# Altium project MezzRev4.PrjPcb (part 4 of 4)

## Sheet DfMUX_Power.SchDoc: Digital fMUX Mezzanine - Power
size 513 x 386 mm; Engineer: M.Dobbs, McGill U.; Revision: 4
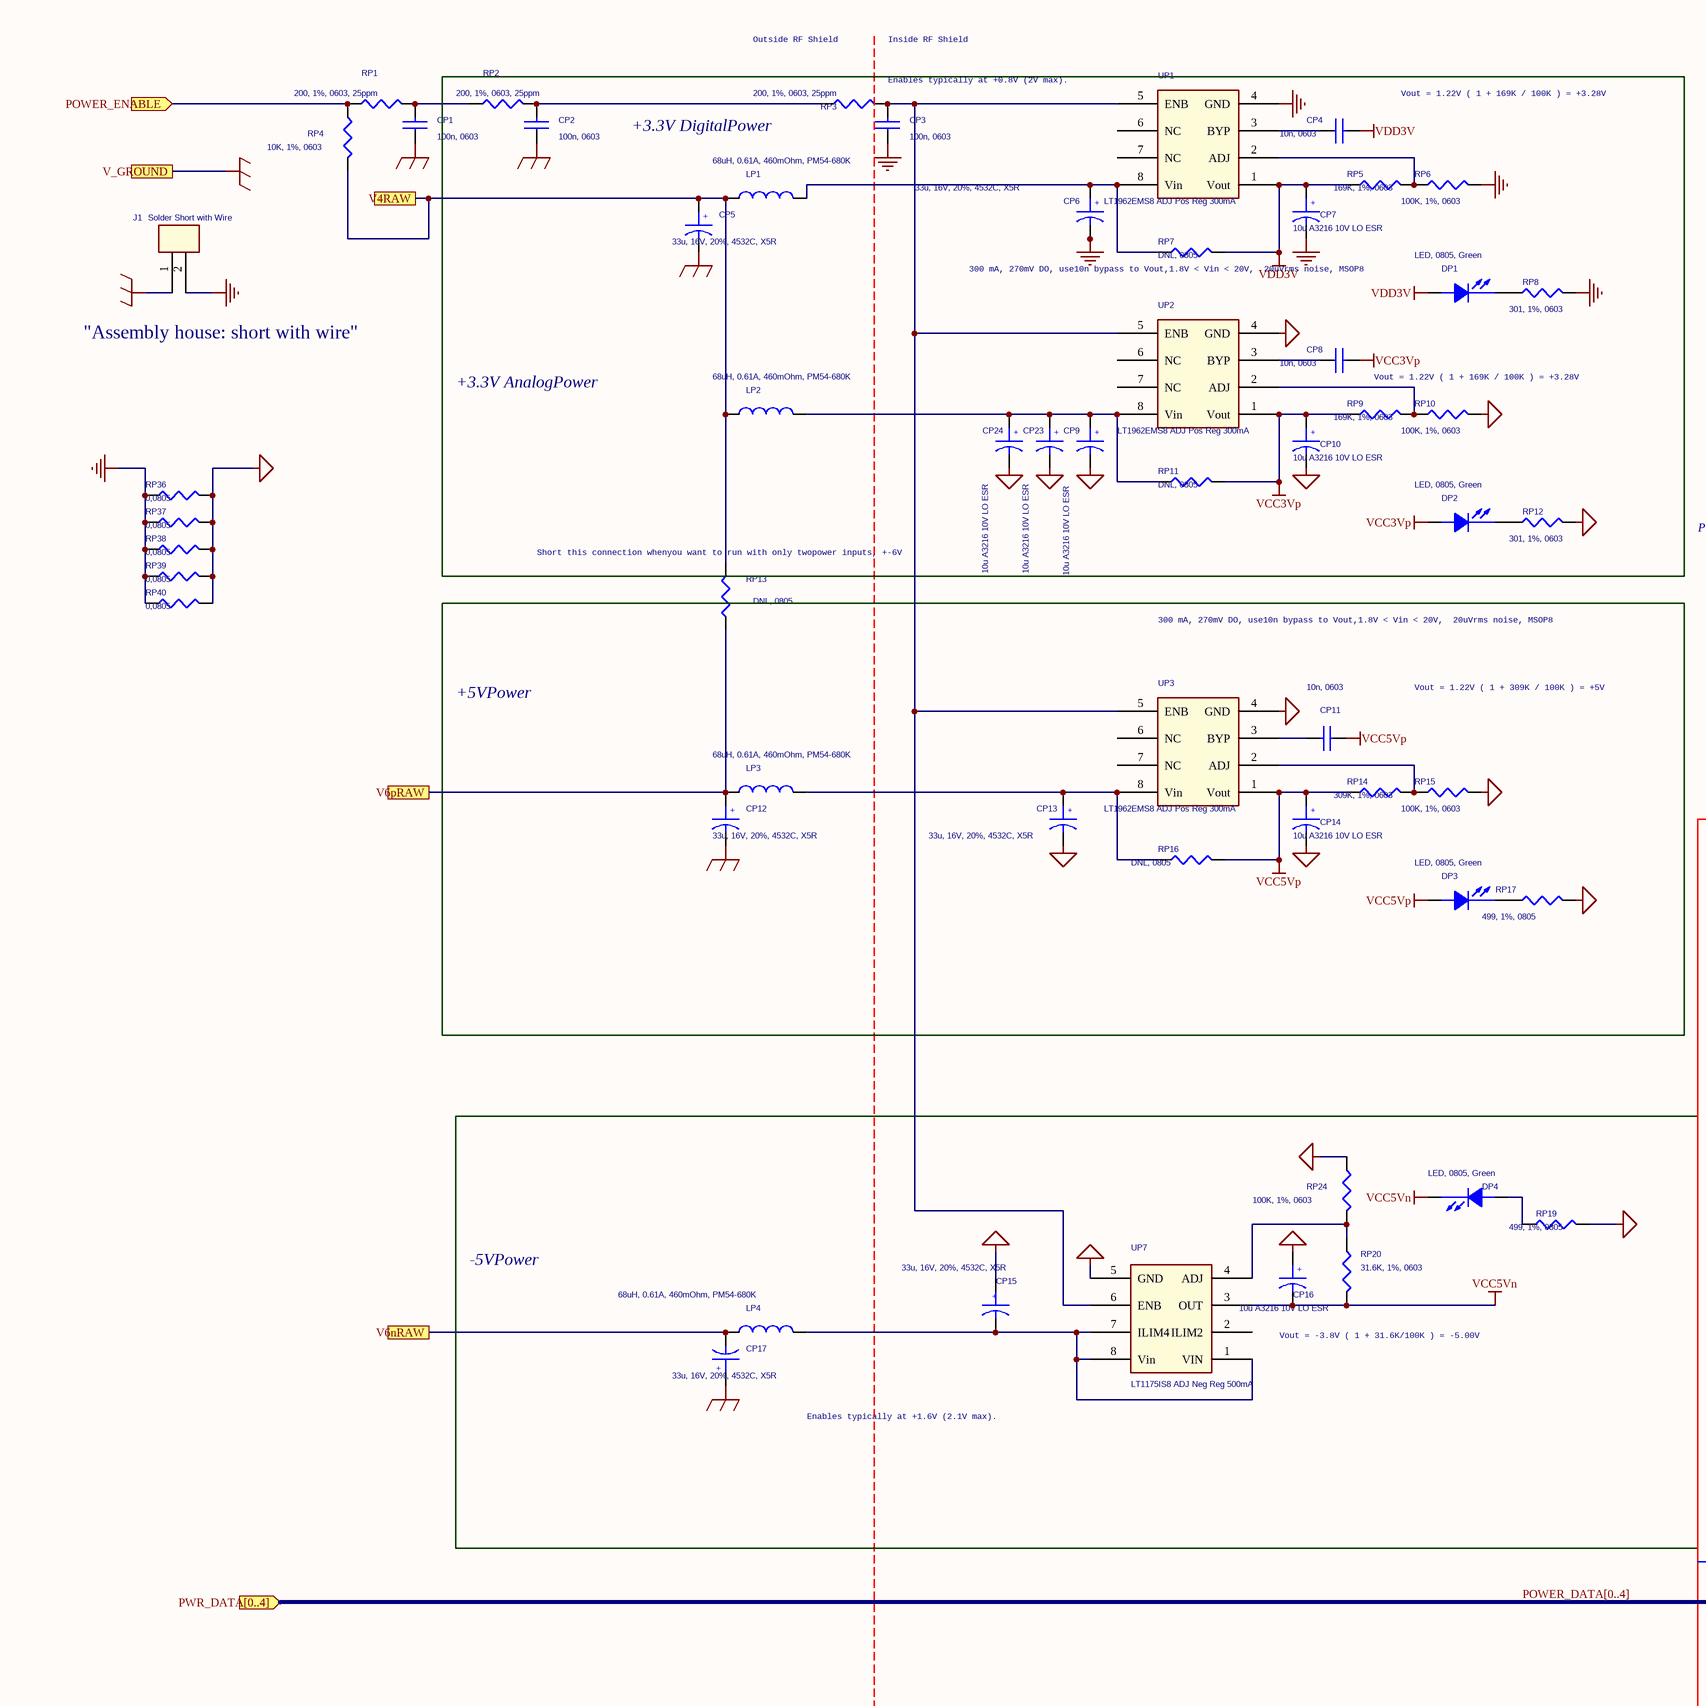
[diagram p7: DfMUX_Power.SchDoc, left]
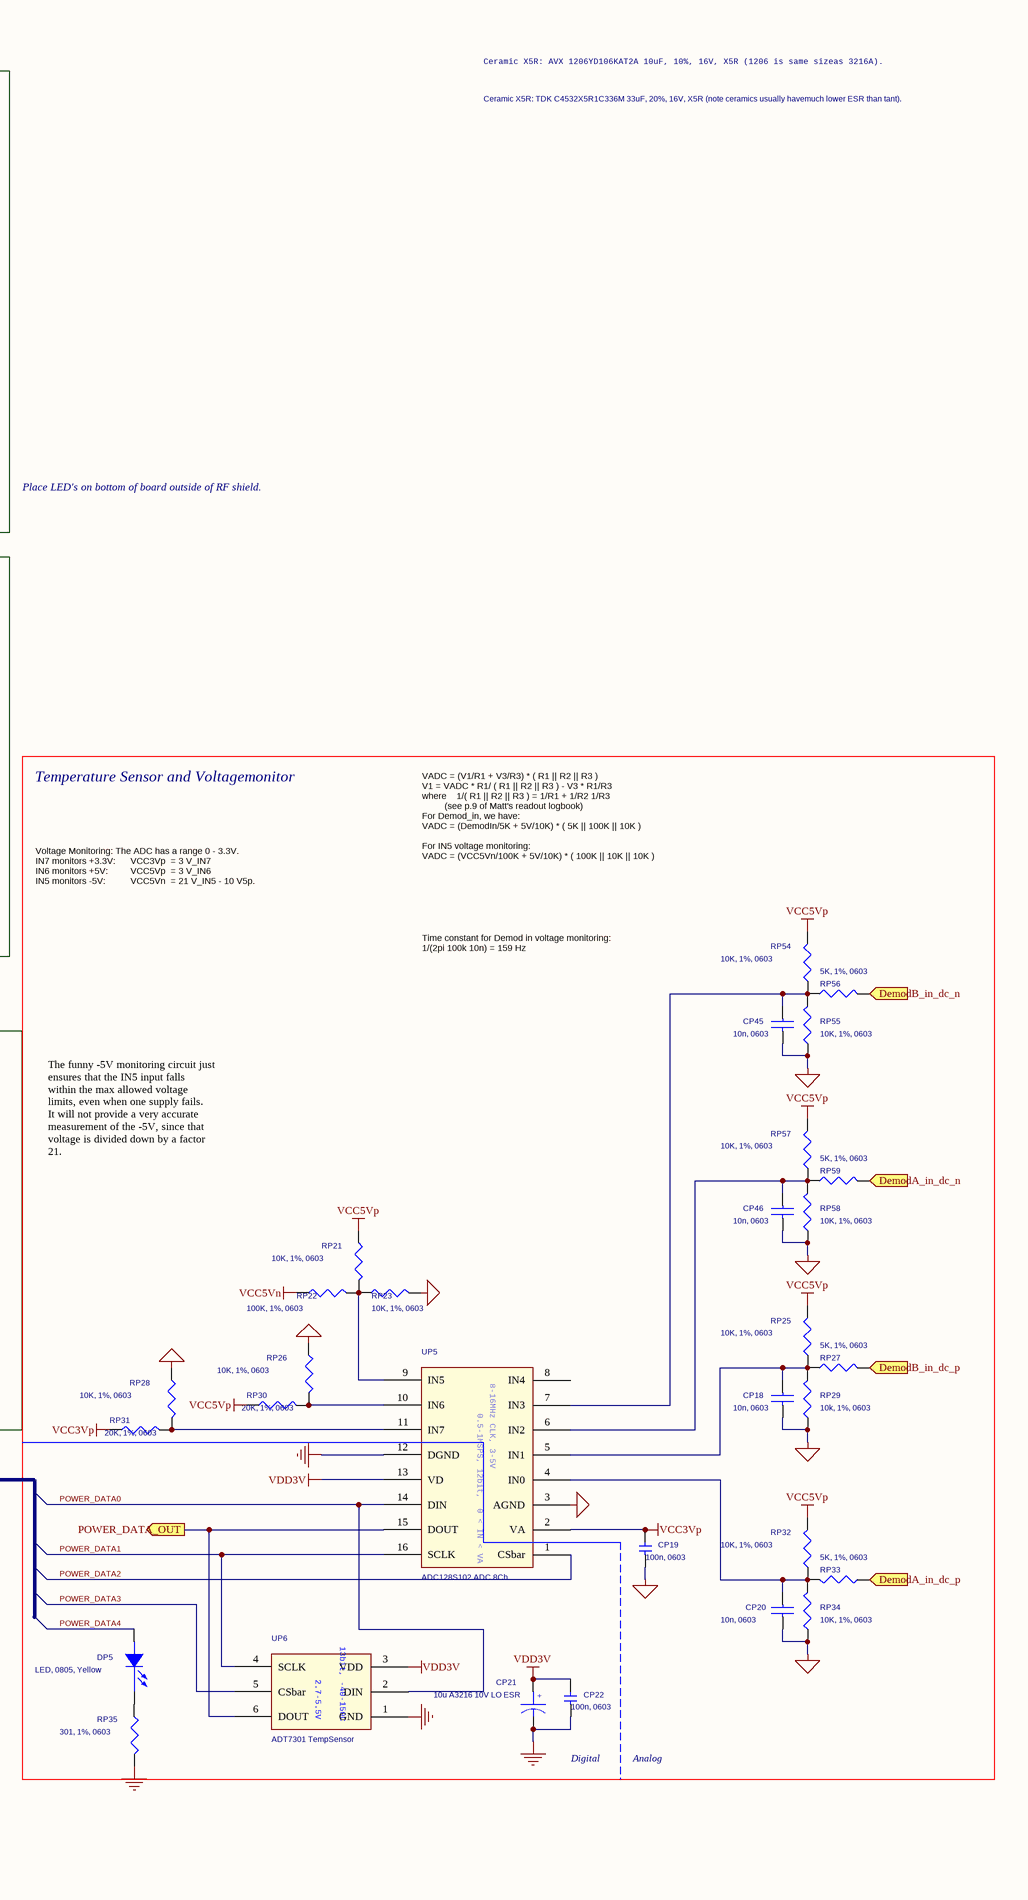
[diagram p8: DfMUX_Power.SchDoc, right]

### Parts
CP1  100n, 0603  [0603C]
CP2  100n, 0603  [0603C]
CP3  100n, 0603  [0603C]
CP4  10n, 0603  [0603C]
CP5  33u, 16V, 20%, 4532C, X5R  [TANT4532]
CP6  33u, 16V, 20%, 4532C, X5R  [TANT4532]
CP7  10u A3216 10V LO ESR  [TANTA]
CP8  10n, 0603  [0603C]
CP9  10u A3216 10V LO ESR  [TANTA]
CP10  10u A3216 10V LO ESR  [TANTA]
CP11  10n, 0603  [0603C]
CP12  33u, 16V, 20%, 4532C, X5R  [TANT4532]
CP13  33u, 16V, 20%, 4532C, X5R  [TANT4532]
CP14  10u A3216 10V LO ESR  [TANTA]
CP15  33u, 16V, 20%, 4532C, X5R  [TANT4532]
CP16  10u A3216 10V LO ESR  [TANTA]
CP17  33u, 16V, 20%, 4532C, X5R  [TANT4532]
CP18  10n, 0603  [0603C]
CP19  100n, 0603  [0603C]
CP20  10n, 0603  [0603C]
CP21  10u A3216 10V LO ESR  [TANTA]
CP22  100n, 0603  [0603C]
CP23  10u A3216 10V LO ESR  [TANTA]
CP24  10u A3216 10V LO ESR  [TANTA]
CP45  10n, 0603  [0603C]
CP46  10n, 0603  [0603C]
DP1  LED, 0805, Green  [0805L]
DP2  LED, 0805, Green  [0805L]
DP3  LED, 0805, Green  [0805L]
DP4  LED, 0805, Green  [0805L]
DP5  LED, 0805, Yellow  [0805L]
J1  Solder Short with Wire  [BLKCON.100/VH/TM1SQS/W.100/2]
LP1  68uH, 0.61A, 460mOhm, PM54-680K  [CHOKEPM54]
LP2  68uH, 0.61A, 460mOhm, PM54-680K  [CHOKEPM54]
LP3  68uH, 0.61A, 460mOhm, PM54-680K  [CHOKEPM54]
LP4  68uH, 0.61A, 460mOhm, PM54-680K  [CHOKEPM54]
RP1  200, 1%, 0603, 25ppm  [0603R]
RP2  200, 1%, 0603, 25ppm  [0603R]
RP3  200, 1%, 0603, 25ppm  [0603R]
RP4  10K, 1%, 0603  [0603R]
RP5  169K, 1%, 0603  [0603R]
RP6  100K, 1%, 0603  [0603R]
RP7  DNL, 0805  [0805R]
RP8  301, 1%, 0603  [0603R]
RP9  169K, 1%, 0603  [0603R]
RP10  100K, 1%, 0603  [0603R]
RP11  DNL, 0805  [0805R]
RP12  301, 1%, 0603  [0603R]
RP13  DNL, 0805  [0805R]
RP14  309K, 1%, 0603  [0603R]
RP15  100K, 1%, 0603  [0603R]
RP16  DNL, 0805  [0805R]
RP17  499, 1%, 0805  [0805R]
RP19  499, 1%, 0805  [0805R]
RP20  31.6K, 1%, 0603  [0603R]
RP21  10K, 1%, 0603  [0603R]
RP22  100K, 1%, 0603  [0603R]
RP23  10K, 1%, 0603  [0603R]
RP24  100K, 1%, 0603  [0603R]
RP25  10K, 1%, 0603  [0603R]
RP26  10K, 1%, 0603  [0603R]
RP27  5K, 1%, 0603  [0603R]
RP28  10K, 1%, 0603  [0603R]
RP29  10k, 1%, 0603  [0603R]
RP30  20K, 1%, 0603  [0603R]
RP31  20K, 1%, 0603  [0603R]
RP32  10K, 1%, 0603  [0603R]
RP33  5K, 1%, 0603  [0603R]
RP34  10K, 1%, 0603  [0603R]
RP35  301, 1%, 0603  [0603R]
RP36  0,0805  [0805R]
RP37  0,0805  [0805R]
RP38  0,0805  [0805R]
RP39  0,0805  [0805R]
RP40  0,0805  [0805R]
RP54  10K, 1%, 0603  [0603R]
RP55  10K, 1%, 0603  [0603R]
RP56  5K, 1%, 0603  [0603R]
RP57  10K, 1%, 0603  [0603R]
RP58  10K, 1%, 0603  [0603R]
RP59  5K, 1%, 0603  [0603R]
UP1  LT1962EMS8 ADJ Pos Reg 300mA  [MSOP-8]
UP2  LT1962EMS8 ADJ Pos Reg 300mA  [MSOP-8]
UP3  LT1962EMS8 ADJ Pos Reg 300mA  [MSOP-8]
UP5  ADC128S102 ADC 8Ch  [TSSOP16]
UP6  ADT7301 TempSensor  [SOT23-6]
UP7  LT1175IS8 ADJ Neg Reg 500mA  [SO8/L200]

### Blocks framed on the sheet
+5V / Power: CP11-CP14 DP3 LP3 RP14-RP17 UP3
Temperature Sensor and Voltage / monitor: CP18-CP22 CP45 CP46 DP5 RP21-RP23 RP25-RP35 RP54-RP59 UP5 UP6
-5V / Power: CP15-CP17 DP4 LP4 RP19 RP20 RP24 UP7

### Ports
DemodA_in_dc_n, DemodA_in_dc_p, DemodB_in_dc_n, DemodB_in_dc_p, POWER_DATA_OUT, POWER_ENABLE, PWR_DATA[0..4], V4RAW, V6nRAW, V6pRAW, V_GROUND

### Nets
GND_DIG: CP3.1 CP6.2 CP7.2 CP21.2 CP22.1 J1.2 RP6.2 RP8.2 RP35.2 RP36.1 RP37.1 RP38.1 RP39.1 RP40.1 UP1.4(GND) UP5.12(DGND) UP6.1(GND)
GND_EARTH: CP1.1 CP2.1 CP5.2 CP12.2 CP17.1 J1.1 ; port V_GROUND
GND_SIGNAL: CP9.2 CP10.2 CP13.2 CP14.2 CP15.1 CP16.1 CP18.2 CP19.1 CP20.2 CP23.2 CP24.2 CP45.2 CP46.2 RP10.2 RP12.2 RP15.2 RP17.2 RP19.2 RP23.2 RP24.1 RP26.1 RP28.1 RP29.1 RP34.1 RP36.2 RP37.2 RP38.2 RP39.2 RP40.2 RP55.1 RP58.1 UP2.4(GND) UP3.4(GND) UP5.3(AGND) UP7.5(GND)
VCC3Vp: CP8.2 CP10.1 CP19.2 DP2.1(ANODE) RP9.1 RP11.2 RP31.1 UP2.1(Vout) UP5.2(VA)
VCC5Vn: CP16.2 DP4.2(CATHODE) RP20.2 RP22.1 UP7.3(OUT)
VCC5Vp: CP11.1 CP14.1 DP3.1(ANODE) RP14.1 RP16.2 RP21.1 RP25.2 RP30.1 RP32.2 RP54.2 RP57.2 UP3.1(Vout)
VDD3V: CP4.2 CP7.1 CP21.1 CP22.2 DP1.1(ANODE) RP5.1 RP7.2 UP1.1(Vout) UP5.13(VD) UP6.3(VDD)
POWER_DATA0: UP5.14(DIN) UP6.2(DIN)
POWER_DATA1: UP5.16(SCLK) UP6.4(SCLK)
POWER_DATA2: UP5.1(CSbar)
POWER_DATA3: UP6.5(CSbar)
POWER_DATA4: DP5.1(ANODE)
NetCA46_1: RP56.2 ; port DemodB_in_dc_n
NetCA47_2: RP27.2 ; port DemodB_in_dc_p
NetCA48_1: RP59.2 ; port DemodA_in_dc_n
NetCA49_2: RP33.1 ; port DemodA_in_dc_p
NetCP1_2: CP1.2 RP1.2 RP2.1
NetCP2_2: CP2.2 RP2.2 RP3.1
NetCP3_2: CP3.2 RP3.2 UP1.5(ENB) UP2.5(ENB) UP3.5(ENB) UP7.6(ENB)
NetCP4_1: CP4.1 UP1.3(BYP)
NetCP5_1: CP5.1 LP1.1 LP2.1 RP4.2 RP13.2 ; port V4RAW
NetCP6_1: CP6.1 LP1.2 RP7.1 UP1.8(Vin)
NetCP8_1: CP8.1 UP2.3(BYP)
NetCP9_1: CP9.1 CP23.1 CP24.1 LP2.2 RP11.1 UP2.8(Vin)
NetCP11_2: CP11.2 UP3.3(BYP)
NetCP12_1: CP12.1 LP3.1 RP13.1 ; port V6pRAW
NetCP13_1: CP13.1 LP3.2 RP16.1 UP3.8(Vin)
NetCP15_2: CP15.2 LP4.2 UP7.1(VIN) UP7.7(ILIM4) UP7.8(Vin)
NetCP17_2: CP17.2 LP4.1 ; port V6nRAW
NetCP18_1: CP18.1 RP25.1 RP27.1 RP29.2 UP5.5(IN1)
NetCP20_1: CP20.1 RP32.1 RP33.2 RP34.2 UP5.4(IN0)
NetCP45_1: CP45.1 RP54.1 RP55.2 RP56.1 UP5.7(IN3)
NetCP46_1: CP46.1 RP57.1 RP58.2 RP59.1 UP5.6(IN2)
NetDP1_2: DP1.2(CATHODE) RP8.1
NetDP2_2: DP2.2(CATHODE) RP12.1
NetDP3_2: DP3.2(CATHODE) RP17.1
NetDP4_1: DP4.1(ANODE) RP19.1
NetDP5_2: DP5.2(CATHODE) RP35.1
NetJ5_74: RP1.1 RP4.1 ; port POWER_ENABLE
NetRP5_2: RP5.2 RP6.1 UP1.2(ADJ)
NetRP9_2: RP9.2 RP10.1 UP2.2(ADJ)
NetRP14_2: RP14.2 RP15.1 UP3.2(ADJ)
NetRP20_1: RP20.1 RP24.2 UP7.4(ADJ)
NetRP21_2: RP21.2 RP22.2 RP23.1 UP5.9(IN5)
NetRP26_2: RP26.2 RP30.2 UP5.10(IN6)
NetRP28_2: RP28.2 RP31.2 UP5.11(IN7)
NetUP5_15: UP5.15(DOUT) UP6.6(DOUT) ; port POWER_DATA_OUT

Not connected (* = marked no-connect by the designer): UP1 6(NC) 7(NC); UP2 6(NC) 7(NC); UP3 6(NC) 7(NC); UP5 8(IN4); UP7 2(ILIM2)

### Buses and harness runs
bus POWER_DATA[0..4] = port PWR_DATA[0..4]

### Notes on the sheet
- Outside RF Shield
- Inside RF Shield
- +3.3V DigitalPower
- Enables typically at +0.8V (2V max).
- Vout = 1.22V ( 1 + 169K / 100K ) = +3.28V
- Ceramic X5R: TDK C4532X5R1C336M 33uF, 20%, 16V, X5R (note ceramics usually havemuch lower ESR than tant).
- Ceramic X5R: AVX 1206YD106KAT2A 10uF, 10%, 16V, X5R (1206 is same sizeas 3216A).
- (near RP7) 300 mA, 270mV DO, use10n bypass to Vout,1.8V < Vin < 20V,  20uVrms noise, MSOP8
- "Assembly house: short with wire"
- +3.3V AnalogPower
- Place LED's on bottom of board outside of RF shield.
- (near RP13) Short this connection whenyou want to run with only twopower inputs, +-6V
- 300 mA, 270mV DO, use10n bypass to Vout,1.8V < Vin < 20V,  20uVrms noise, MSOP8
- Vout = 1.22V ( 1 + 309K / 100K ) = +5V
- Voltage Monitoring: The ADC has a range 0 - 3.3V.
  IN7 monitors +3.3V:      VCC3Vp  = 3 V_IN7
  IN6 monitors +5V:         VCC5Vp  = 3 V_IN6
  IN5 monitors -5V:          VCC5Vn  = 21 V_IN5 - 10 V5p.
- (near RP54) VADC = (V1/R1 + V3/R3) * ( R1 || R2 || R3 )
  V1 = VADC * R1/ ( R1 || R2 || R3 ) - V3 * R1/R3
  where    1/( R1 || R2 || R3 ) = 1/R1 + 1/R2 1/R3
  (see p.9 of Matt's readout logbook)
  For Demod_in, we have:
  VADC = (DemodIn/5K + 5V/10K) * ( 5K || 100K || 10K )
  For IN5 voltage monitoring:
  VADC = (VCC5Vn/100K + 5V/10K) * ( 100K || 10K || 10K )
- Time constant for Demod in voltage monitoring:
  1/(2pi 100k 10n) = 159 Hz
- Vout = -3.8V ( 1 + 31.6K/100K ) = -5.00V
- The funny -5V monitoring circuit just
  ensures that the IN5 input falls
  within the max allowed voltage
  limits, even when one supply fails.
  It will not provide a very accurate
  measurement of the -5V, since that
  voltage is divided down by a factor
  21.
- Enables typically at +1.6V (2.1V max).
- Digital
- Analog
- (in symbol ADC128S102 ADC 8Ch) 8-16MHz CLK, 3-5V; 0.5-1MSPS, 12bit,  0 < IN < VA
- (in symbol ADT7301 TempSensor) 13bit, -40-150C; 2.7-5.5V
- (in symbol CAP_POL) +
- (in symbol CAPACITOR POL) +

### Library data of the parts
CP1 = CAP NP: COMPFIXED: NO; COMPGROUP: 0; COMPHEIGHT: 0.000; COMPLOC: [1034.633,740.000]; COMPSIDE: TOP; COMPKEY: NO; COMPLOCKED: NO; COMPROT: 0; DECOUPLER: NO; MEMORY: NO
CP2 = CAP NP: COMPFIXED: NO; COMPGROUP: 0; COMPHEIGHT: 0.000; COMPLOC: [1039.633,1155.000]; COMPSIDE: TOP; COMPKEY: NO; COMPLOCKED: NO; COMPROT: 0; DECOUPLER: NO; MEMORY: NO
CP3 = CAP NP: COMPFIXED: NO; COMPGROUP: 0; COMPHEIGHT: 0.000; COMPLOC: [1372.633,1318.000]; COMPSIDE: BOT; COMPKEY: NO; COMPLOCKED: NO; COMPROT: 0; DECOUPLER: NO; MEMORY: NO
CP4 = CAP NP: COMPFIXED: NO; COMPGROUP: 0; COMPHEIGHT: 0.000; COMPLOC: [1429.633,1320.000]; COMPROT: 180; COMPSIDE: BOT; COMPKEY: NO; COMPLOCKED: NO; DECOUPLER: NO; MEMORY: NO
CP5 = CAP_POL: COMPFIXED: NO; COMPGROUP: 0; COMPHEIGHT: 0.000; COMPLOC: [539.633,1474.367]; COMPSIDE: TOP; COMPKEY: NO; COMPLOCKED: NO; COMPROT: 0; DECOUPLER: NO; MEMORY: NO
CP6 = CAP_POL: COMPFIXED: NO; COMPGROUP: 0; COMPHEIGHT: 0.000; COMPLOC: [1309.633,1595.000]; COMPROT: 90; COMPSIDE: TOP; COMPKEY: NO; COMPLOCKED: NO; DECOUPLER: NO; MEMORY: NO
CP7 = CAP_POL: COMPFIXED: NO; COMPGROUP: 0; COMPHEIGHT: 0.000; COMPLOC: [1523.633,1584.000]; COMPROT: 90; COMPSIDE: TOP; COMPKEY: NO; COMPLOCKED: NO; DECOUPLER: NO; MEMORY: NO
CP8 = CAP NP: COMPFIXED: NO; COMPGROUP: 0; COMPHEIGHT: 0.000; COMPLOC: [2397.633,1480.000]; COMPROT: 90; COMPSIDE: TOP; COMPKEY: NO; COMPLOCKED: NO; DECOUPLER: NO; MEMORY: NO
CP9 = CAP_POL: COMPFIXED: NO; COMPGROUP: 0; COMPHEIGHT: 0.000; COMPLOC: [2205.000,1380.000]; COMPROT: 90; COMPSIDE: BOT; FPLIST: TANT4532; COMPKEY: NO; COMPLOCKED: NO; DECOUPLER: NO; MEMORY: NO
CP10 = CAP_POL: COMPFIXED: NO; COMPGROUP: 0; COMPHEIGHT: 0.000; COMPLOC: [2347.633,1365.000]; COMPSIDE: TOP; COMPKEY: NO; COMPLOCKED: NO; COMPROT: 0; DECOUPLER: NO; MEMORY: NO
CP11 = CAP NP: COMPFIXED: NO; COMPGROUP: 0; COMPHEIGHT: 0.000; COMPLOC: [2267.633,3385.000]; COMPROT: 90; COMPSIDE: BOT; COMPKEY: NO; COMPLOCKED: NO; DECOUPLER: NO; MEMORY: NO
CP12 = CAP_POL: COMPFIXED: NO; COMPGROUP: 0; COMPHEIGHT: 0.000; COMPLOC: [689.633,3195.000]; COMPROT: 270; COMPSIDE: TOP; COMPKEY: NO; COMPLOCKED: NO; DECOUPLER: NO; MEMORY: NO
CP13 = CAP_POL: COMPFIXED: NO; COMPGROUP: 0; COMPHEIGHT: 0.000; COMPLOC: [1619.633,3500.000]; COMPSIDE: TOP; COMPKEY: NO; COMPLOCKED: NO; COMPROT: 0; DECOUPLER: NO; MEMORY: NO
CP14 = CAP_POL: COMPFIXED: NO; COMPGROUP: 0; COMPHEIGHT: 0.000; COMPLOC: [2192.633,3445.000]; COMPROT: 180; COMPSIDE: BOT; COMPKEY: NO; COMPLOCKED: NO; DECOUPLER: NO; MEMORY: NO
CP15 = CAP_POL: COMPFIXED: NO; COMPGROUP: 0; COMPHEIGHT: 0.000; COMPLOC: [2204.633,120.000]; COMPROT: 180; COMPSIDE: TOP; COMPKEY: NO; COMPLOCKED: NO; DECOUPLER: NO; MEMORY: NO
CP16 = CAP_POL: COMPFIXED: NO; COMPGROUP: 0; COMPHEIGHT: 0.000; COMPLOC: [2319.633,355.000]; COMPROT: 180; COMPSIDE: BOT; COMPKEY: NO; COMPLOCKED: NO; DECOUPLER: NO; MEMORY: NO
CP17 = CAP_POL: COMPFIXED: NO; COMPGROUP: 0; COMPHEIGHT: 0.000; COMPLOC: [709.633,385.000]; COMPROT: 180; COMPSIDE: TOP; COMPKEY: NO; COMPLOCKED: NO; DECOUPLER: NO; MEMORY: NO
CP18 = CAP NP: COMPFIXED: NO; COMPGROUP: 0; COMPHEIGHT: 0.000; COMPLOC: [3832.633,1939.367]; COMPROT: 90; COMPSIDE: TOP; COMPKEY: NO; COMPLOCKED: NO; DECOUPLER: NO; MEMORY: NO
CP19 = C: PSpiceTemplate: C^@REFDES %1 %2 ?TOLERANCE|C^@REFDES| @VALUE ?IC/IC=@IC/ ?TOLERANCE|\n.model C^@REFDES CAP C=1 DEV=@TOLERANCE%|; COMPFIXED: NO; COMPGROUP: 0; COMPHEIGHT: 0.000; COMPLOC: [1827.633,1264.367]; COMPSIDE: BOT; Value: 100n, 0603; COMPKEY: NO; COMPLOCKED: NO; COMPROT: 0; DECOUPLER: NO; MEMORY: NO
CP20 = CAP NP: COMPFIXED: NO; COMPGROUP: 0; COMPHEIGHT: 0.000; COMPLOC: [3837.633,1434.367]; COMPROT: 90; COMPSIDE: TOP; COMPKEY: NO; COMPLOCKED: NO; DECOUPLER: NO; MEMORY: NO
CP21 = CAPACITOR POL: COMPFIXED: NO; COMPGROUP: 0; COMPHEIGHT: 0.000; COMPLOC: [1897.633,1559.367]; COMPROT: 180; COMPSIDE: TOP; COMPKEY: NO; COMPLOCKED: NO; DECOUPLER: NO; MEMORY: NO
CP22 = C: PSpiceTemplate: C^@REFDES %1 %2 ?TOLERANCE|C^@REFDES| @VALUE ?IC/IC=@IC/ ?TOLERANCE|\n.model C^@REFDES CAP C=1 DEV=@TOLERANCE%|; COMPFIXED: NO; COMPGROUP: 0; COMPHEIGHT: 0.000; COMPLOC: [1657.633,1459.367]; COMPSIDE: TOP; Value: 100n, 0603; COMPKEY: NO; COMPLOCKED: NO; COMPROT: 0; DECOUPLER: NO; MEMORY: NO
CP23 CP24 = CAP_POL
CP45 CP46 = CAP NP
DP1 = LED: COMPFIXED: NO; COMPGROUP: 0; COMPHEIGHT: 0.000; COMPLOC: [1354.633,2215.000]; COMPROT: 270; COMPSIDE: BOT; COMPKEY: NO; COMPLOCKED: NO; DECOUPLER: NO; MEMORY: NO
DP2 = LED: COMPFIXED: NO; COMPGROUP: 0; COMPHEIGHT: 0.000; COMPLOC: [2401.633,2092.000]; COMPROT: 90; COMPSIDE: BOT; COMPKEY: NO; COMPLOCKED: NO; DECOUPLER: NO; MEMORY: NO
DP3 = LED: COMPFIXED: NO; COMPGROUP: 0; COMPHEIGHT: 0.000; COMPLOC: [2144.633,3525.000]; COMPROT: 180; COMPSIDE: BOT; COMPKEY: NO; COMPLOCKED: NO; DECOUPLER: NO; MEMORY: NO
DP4 = LED: COMPFIXED: NO; COMPGROUP: 0; COMPHEIGHT: 0.000; COMPLOC: [2839.633,145.000]; COMPSIDE: BOT; COMPKEY: NO; COMPLOCKED: NO; COMPROT: 0; DECOUPLER: NO; MEMORY: NO
DP5 = LED: COMPFIXED: NO; COMPGROUP: 0; COMPHEIGHT: 0.000; COMPLOC: [1264.633,393.367]; COMPROT: 90; COMPSIDE: BOT; COMPKEY: NO; COMPLOCKED: NO; DECOUPLER: NO; MEMORY: NO
J1 = CON2: COMPFIXED: NO; COMPGROUP: 0; COMPHEIGHT: 0.000; COMPLOC: [979.633,105.000]; COMPSIDE: TOP; FPLIST: HEADER_AMP146128; COMPKEY: NO; COMPLOCKED: NO; COMPROT: 0; DECOUPLER: NO; MEMORY: NO
LP1 = L: PSpiceTemplate: L^@REFDES %1 %2 ?TOLERANCE|L^@REFDES| @VALUE ?IC/IC=@IC/ ?TOLERANCE|\n.model l^@REFDES IND L=1 DEV=@TOLERANCE%|; COMPFIXED: NO; COMPGROUP: 0; COMPHEIGHT: 0.000; COMPLOC: [549.633,1744.367]; COMPSIDE: TOP; Value: 68uH, 0.61A, 460mOhm, PM54-680K; COMPKEY: NO; COMPLOCKED: NO; COMPROT: 0; DECOUPLER: NO; MEMORY: NO
LP2 = L: PSpiceTemplate: L^@REFDES %1 %2 ?TOLERANCE|L^@REFDES| @VALUE ?IC/IC=@IC/ ?TOLERANCE|\n.model l^@REFDES IND L=1 DEV=@TOLERANCE%|; COMPFIXED: NO; COMPGROUP: 0; COMPHEIGHT: 0.000; COMPLOC: [549.633,1229.367]; COMPSIDE: TOP; Value: 68uH, 0.61A, 460mOhm, PM54-680K; COMPKEY: NO; COMPLOCKED: NO; COMPROT: 0; DECOUPLER: NO; MEMORY: NO
LP3 = L: PSpiceTemplate: L^@REFDES %1 %2 ?TOLERANCE|L^@REFDES| @VALUE ?IC/IC=@IC/ ?TOLERANCE|\n.model l^@REFDES IND L=1 DEV=@TOLERANCE%|; COMPFIXED: NO; COMPGROUP: 0; COMPHEIGHT: 0.000; COMPLOC: [559.633,3390.000]; COMPSIDE: TOP; Value: 68uH, 0.61A, 460mOhm, PM54-680K; COMPKEY: NO; COMPLOCKED: NO; COMPROT: 0; DECOUPLER: NO; MEMORY: NO
LP4 = L: PSpiceTemplate: L^@REFDES %1 %2 ?TOLERANCE|L^@REFDES| @VALUE ?IC/IC=@IC/ ?TOLERANCE|\n.model l^@REFDES IND L=1 DEV=@TOLERANCE%|; COMPFIXED: NO; COMPGROUP: 0; COMPHEIGHT: 0.000; COMPLOC: [514.633,175.000]; COMPSIDE: TOP; Value: 68uH, 0.61A, 460mOhm, PM54-680K; COMPKEY: NO; COMPLOCKED: NO; COMPROT: 0; DECOUPLER: NO; MEMORY: NO
RP1 = R_Dup1: COMPFIXED: NO; COMPGROUP: 0; COMPHEIGHT: 0.000; COMPLOC: [1074.633,625.000]; COMPROT: 90; COMPSIDE: TOP; COMPKEY: NO; COMPLOCKED: NO; DECOUPLER: NO; MEMORY: NO
RP2 = R_Dup1: COMPFIXED: NO; COMPGROUP: 0; COMPHEIGHT: 0.000; COMPLOC: [1089.633,855.000]; COMPROT: 90; COMPSIDE: TOP; COMPKEY: NO; COMPLOCKED: NO; DECOUPLER: NO; MEMORY: NO
RP3 = R_Dup1: COMPFIXED: NO; COMPGROUP: 0; COMPHEIGHT: 0.000; COMPLOC: [1094.633,1210.000]; COMPROT: 90; COMPSIDE: TOP; COMPKEY: NO; COMPLOCKED: NO; DECOUPLER: NO; MEMORY: NO
RP4 = R_Dup1: COMPFIXED: NO; COMPGROUP: 0; COMPHEIGHT: 0.000; COMPLOC: [449.633,476.000]; COMPROT: 270; COMPSIDE: TOP; COMPKEY: NO; COMPLOCKED: NO; DECOUPLER: NO; MEMORY: NO
RP5 = R: COMPFIXED: NO; COMPGROUP: 0; COMPHEIGHT: 0.000; COMPLOC: [1554.633,1540.000]; COMPROT: 90; COMPSIDE: BOT; COMPKEY: NO; COMPLOCKED: NO; DECOUPLER: NO; MEMORY: NO
RP6 = R: COMPFIXED: NO; COMPGROUP: 0; COMPHEIGHT: 0.000; COMPLOC: [1554.633,1445.000]; COMPROT: 90; COMPSIDE: BOT; COMPKEY: NO; COMPLOCKED: NO; DECOUPLER: NO; MEMORY: NO
RP7 = R_Dup1: COMPFIXED: NO; COMPGROUP: 0; COMPHEIGHT: 0.000; COMPLOC: [1364.633,1505.000]; COMPROT: 180; COMPSIDE: BOT; COMPKEY: NO; COMPLOCKED: NO; DECOUPLER: NO; MEMORY: NO
RP8 = R_Dup1: COMPFIXED: NO; COMPGROUP: 0; COMPHEIGHT: 0.000; COMPLOC: [1356.633,2377.000]; COMPROT: 270; COMPSIDE: BOT; COMPKEY: NO; COMPLOCKED: NO; DECOUPLER: NO; MEMORY: NO
RP9 = R: COMPFIXED: NO; COMPGROUP: 0; COMPHEIGHT: 0.000; COMPLOC: [2452.633,1535.000]; COMPROT: 270; COMPSIDE: TOP; COMPKEY: NO; COMPLOCKED: NO; DECOUPLER: NO; MEMORY: NO
RP10 = R: COMPFIXED: NO; COMPGROUP: 0; COMPHEIGHT: 0.000; COMPLOC: [2397.633,1425.000]; COMPSIDE: TOP; COMPKEY: NO; COMPLOCKED: NO; COMPROT: 0; DECOUPLER: NO; MEMORY: NO
RP11 = R_Dup1: COMPFIXED: NO; COMPGROUP: 0; COMPHEIGHT: 0.000; COMPLOC: [2192.633,1365.000]; COMPSIDE: TOP; COMPKEY: NO; COMPLOCKED: NO; COMPROT: 0; DECOUPLER: NO; MEMORY: NO
RP12 = R_Dup1: COMPFIXED: NO; COMPGROUP: 0; COMPHEIGHT: 0.000; COMPLOC: [2402.633,1943.000]; COMPROT: 90; COMPSIDE: BOT; COMPKEY: NO; COMPLOCKED: NO; DECOUPLER: NO; MEMORY: NO
RP13 = R_Dup1: COMPFIXED: NO; COMPGROUP: 0; COMPHEIGHT: 0.000; COMPLOC: [564.633,3225.000]; COMPROT: 270; COMPSIDE: TOP; COMPKEY: NO; COMPLOCKED: NO; DECOUPLER: NO; MEMORY: NO
RP14 = R: COMPFIXED: NO; COMPGROUP: 0; COMPHEIGHT: 0.000; COMPLOC: [2324.633,3383.000]; COMPROT: 90; COMPSIDE: BOT; COMPKEY: NO; COMPLOCKED: NO; DECOUPLER: NO; MEMORY: NO
RP15 = R: COMPFIXED: NO; COMPGROUP: 0; COMPHEIGHT: 0.000; COMPLOC: [2379.633,3327.000]; COMPROT: 270; COMPSIDE: BOT; COMPKEY: NO; COMPLOCKED: NO; DECOUPLER: NO; MEMORY: NO
RP16 = R_Dup1: COMPFIXED: NO; COMPGROUP: 0; COMPHEIGHT: 0.000; COMPLOC: [2002.633,3445.000]; COMPROT: 180; COMPSIDE: BOT; COMPKEY: NO; COMPLOCKED: NO; DECOUPLER: NO; MEMORY: NO
RP17 = R_Dup1: COMPFIXED: NO; COMPGROUP: 0; COMPHEIGHT: 0.000; COMPLOC: [2294.633,3525.000]; COMPROT: 180; COMPSIDE: BOT; COMPKEY: NO; COMPLOCKED: NO; DECOUPLER: NO; MEMORY: NO
RP19 = R_Dup1: COMPFIXED: NO; COMPGROUP: 0; COMPHEIGHT: 0.000; COMPLOC: [2909.633,145.000]; COMPROT: 180; COMPSIDE: BOT; COMPKEY: NO; COMPLOCKED: NO; DECOUPLER: NO; MEMORY: NO
RP20 = R: COMPFIXED: NO; COMPGROUP: 0; COMPHEIGHT: 0.000; COMPLOC: [2514.633,314.000]; COMPROT: 270; COMPSIDE: BOT; COMPKEY: NO; COMPLOCKED: NO; DECOUPLER: NO; MEMORY: NO
RP21 = R_Dup1: COMPFIXED: NO; COMPGROUP: 0; COMPHEIGHT: 0.000; COMPLOC: [2032.633,1370.000]; COMPROT: 180; COMPSIDE: TOP; COMPKEY: NO; COMPLOCKED: NO; DECOUPLER: NO; MEMORY: NO
RP22 = R_Dup1: COMPFIXED: NO; COMPGROUP: 0; COMPHEIGHT: 0.000; COMPLOC: [2032.633,1429.367]; COMPROT: 180; COMPSIDE: TOP; COMPKEY: NO; COMPLOCKED: NO; DECOUPLER: NO; MEMORY: NO
RP23 = R_Dup1: COMPFIXED: NO; COMPGROUP: 0; COMPHEIGHT: 0.000; COMPLOC: [1977.633,1489.367]; COMPSIDE: TOP; COMPKEY: NO; COMPLOCKED: NO; COMPROT: 0; DECOUPLER: NO; MEMORY: NO
RP24 = R: COMPFIXED: NO; COMPGROUP: 0; COMPHEIGHT: 0.000; COMPLOC: [2569.633,371.000]; COMPROT: 90; COMPSIDE: BOT; COMPKEY: NO; COMPLOCKED: NO; DECOUPLER: NO; MEMORY: NO
RP25 = R_Dup1: COMPFIXED: NO; COMPGROUP: 0; COMPHEIGHT: 0.000; COMPLOC: [3697.633,1889.367]; COMPROT: 180; COMPSIDE: TOP; COMPKEY: NO; COMPLOCKED: NO; DECOUPLER: NO; MEMORY: NO
RP26 = R_Dup1: COMPFIXED: NO; COMPGROUP: 0; COMPHEIGHT: 0.000; COMPLOC: [2095.633,1251.367]; COMPROT: 90; COMPSIDE: TOP; COMPKEY: NO; COMPLOCKED: NO; DECOUPLER: NO; MEMORY: NO
RP27 = R_Dup1: COMPFIXED: NO; COMPGROUP: 0; COMPHEIGHT: 0.000; COMPLOC: [3775.633,1936.367]; COMPROT: 90; COMPSIDE: TOP; COMPKEY: NO; COMPLOCKED: NO; DECOUPLER: NO; MEMORY: NO
RP28 = R_Dup1: COMPFIXED: NO; COMPGROUP: 0; COMPHEIGHT: 0.000; COMPLOC: [2037.633,1249.367]; COMPROT: 90; COMPSIDE: TOP; COMPKEY: NO; COMPLOCKED: NO; DECOUPLER: NO; MEMORY: NO
RP29 = R_Dup1: COMPFIXED: NO; COMPGROUP: 0; COMPHEIGHT: 0.000; COMPLOC: [3793.633,1889.367]; COMPROT: 180; COMPSIDE: TOP; COMPKEY: NO; COMPLOCKED: NO; DECOUPLER: NO; MEMORY: NO
RP30 = R_Dup1: COMPFIXED: NO; COMPGROUP: 0; COMPHEIGHT: 0.000; COMPLOC: [2150.633,1250.367]; COMPROT: 90; COMPSIDE: TOP; COMPKEY: NO; COMPLOCKED: NO; DECOUPLER: NO; MEMORY: NO
RP31 = R_Dup1: COMPFIXED: NO; COMPGROUP: 0; COMPHEIGHT: 0.000; COMPLOC: [1977.633,1249.367]; COMPROT: 90; COMPSIDE: TOP; COMPKEY: NO; COMPLOCKED: NO; DECOUPLER: NO; MEMORY: NO
RP32 = R_Dup1: COMPFIXED: NO; COMPGROUP: 0; COMPHEIGHT: 0.000; COMPLOC: [3697.633,1389.367]; COMPROT: 180; COMPSIDE: TOP; COMPKEY: NO; COMPLOCKED: NO; DECOUPLER: NO; MEMORY: NO
RP33 = R_Dup1: COMPFIXED: NO; COMPGROUP: 0; COMPHEIGHT: 0.000; COMPLOC: [3782.633,1489.367]; COMPROT: 270; COMPSIDE: TOP; COMPKEY: NO; COMPLOCKED: NO; DECOUPLER: NO; MEMORY: NO
RP34 = R_Dup1: COMPFIXED: NO; COMPGROUP: 0; COMPHEIGHT: 0.000; COMPLOC: [3797.633,1389.367]; COMPROT: 180; COMPSIDE: TOP; COMPKEY: NO; COMPLOCKED: NO; DECOUPLER: NO; MEMORY: NO
RP35 = R_Dup1: COMPFIXED: NO; COMPGROUP: 0; COMPHEIGHT: 0.000; COMPLOC: [1264.633,260.000]; COMPROT: 90; COMPSIDE: BOT; COMPKEY: NO; COMPLOCKED: NO; DECOUPLER: NO; MEMORY: NO
RP36 = R_Dup1: COMPFIXED: NO; COMPGROUP: 0; COMPHEIGHT: 0.000; COMPLOC: [1724.633,2905.000]; COMPROT: 180; COMPSIDE: BOT; COMPKEY: NO; COMPLOCKED: NO; DECOUPLER: NO; MEMORY: NO
RP37 = R_Dup1: COMPFIXED: NO; COMPGROUP: 0; COMPHEIGHT: 0.000; COMPLOC: [1710.633,2445.000]; COMPROT: 180; COMPSIDE: BOT; COMPKEY: NO; COMPLOCKED: NO; DECOUPLER: NO; MEMORY: NO
RP38 = R_Dup1: COMPFIXED: NO; COMPGROUP: 0; COMPHEIGHT: 0.000; COMPLOC: [1854.633,1908.000]; COMPROT: 180; COMPSIDE: BOT; COMPKEY: NO; COMPLOCKED: NO; DECOUPLER: NO; MEMORY: NO
RP39 = R_Dup1: COMPFIXED: NO; COMPGROUP: 0; COMPHEIGHT: 0.000; COMPLOC: [1730.633,830.000]; COMPROT: 180; COMPSIDE: BOT; COMPKEY: NO; COMPLOCKED: NO; DECOUPLER: NO; MEMORY: NO
RP40 = R_Dup1: COMPFIXED: NO; COMPGROUP: 0; COMPHEIGHT: 0.000; COMPLOC: [1731.633,384.000]; COMPROT: 180; COMPSIDE: BOT; COMPKEY: NO; COMPLOCKED: NO; DECOUPLER: NO; MEMORY: NO
RP54-RP59 = R_Dup1
UP1 = LT1962EMS8_0_Dup1: COMPFIXED: NO; COMPGROUP: 0; COMPHEIGHT: 0.000; COMPLOC: [1489.633,1445.000]; COMPROT: 90; COMPSIDE: BOT; COMPKEY: NO; COMPLOCKED: NO; DECOUPLER: NO; MEMORY: NO
UP2 = LT1962EMS8_0_Dup1: COMPFIXED: NO; COMPGROUP: 0; COMPHEIGHT: 0.000; COMPLOC: [2332.633,1420.000]; COMPROT: 90; COMPSIDE: TOP; COMPKEY: NO; COMPLOCKED: NO; DECOUPLER: NO; MEMORY: NO
UP3 = LT1962EMS8_0_Dup1: COMPFIXED: NO; COMPGROUP: 0; COMPHEIGHT: 0.000; COMPLOC: [2192.633,3385.000]; COMPROT: 90; COMPSIDE: BOT; COMPKEY: NO; COMPLOCKED: NO; DECOUPLER: NO; MEMORY: NO
UP5 = ADC128S102 ADC 8Ch: COMPFIXED: NO; COMPGROUP: 0; COMPHEIGHT: 0.000; COMPLOC: [1755.933,1241.800]; COMPSIDE: TOP; COMPKEY: NO; COMPLOCKED: NO; COMPROT: 0; DECOUPLER: NO; MEMORY: NO
UP6 = ADT7301 TempSensor: COMPFIXED: NO; COMPGROUP: 0; COMPHEIGHT: 0.000; COMPLOC: [1712.633,1314.367]; COMPROT: 90; COMPSIDE: TOP; COMPKEY: NO; COMPLOCKED: NO; DECOUPLER: NO; MEMORY: NO
UP7 = LT1962EMS8_5: COMPFIXED: NO; COMPGROUP: 0; COMPHEIGHT: 0.000; COMPLOC: [2454.633,100.000]; COMPROT: 270; COMPSIDE: BOT; COMPKEY: NO; COMPLOCKED: NO; DECOUPLER: NO; MEMORY: NO

## Nets that join several sheets
GND_DIG: Top (23 pins), dac_block1 (=Ud1_PartReference_dac_block1.24), transceiver_block2 (8 pins), transceiver_block3 (8 pins), transceiver_block6 (10 pins), transceiver_block1 (8 pins), transceiver_block5 (10 pins), transceiver_block4 (8 pins), dac_block4 (=Ud1_PartReference_dac_block4.24), DfMUX_ADC (10 pins), DfMUX_Power (17 pins), dac_block2 (=Ud1_PartReference_dac_block2.24), dac_block3 (=Ud1_PartReference_dac_block3.24)
GND_EARTH: Top (28 pins), transceiver_block2 (6 pins), transceiver_block3 (6 pins), transceiver_block6 (6 pins), transceiver_block1 (6 pins), transceiver_block5 (6 pins), transceiver_block4 (6 pins), DfMUX_Power (6 pins)
GND_SIGNAL: Top (17 pins), dac_block1 (22 pins), dac_block4 (22 pins), DfMUX_ADC (43 pins), DfMUX_Power (35 pins), dac_block2 (22 pins), dac_block3 (22 pins)
VCC3Vp: DfMUX_ADC (10 pins), DfMUX_Power (9 pins)
VCC5Vn: dac_block1 (11 pins), dac_block4 (11 pins), DfMUX_ADC (12 pins), DfMUX_Power (5 pins), dac_block2 (11 pins), dac_block3 (11 pins)
VCC5Vp: dac_block1 (13 pins), dac_block4 (13 pins), DfMUX_ADC (20 pins), DfMUX_Power (12 pins), dac_block2 (13 pins), dac_block3 (13 pins)
VDD3V: Top (11 pins), transceiver_block2 (6 pins), transceiver_block3 (6 pins), transceiver_block6 (=Ct3_PartReference_transceiver_block6.1 =t4_PartReference_transceiver_block6.2 =Ut1_PartReference_transceiver_block6.7 =Ut1_PartReference_transceiver_block6.18), transceiver_block1 (6 pins), transceiver_block5 (=Ct3_PartReference_transceiver_block5.1 =t4_PartReference_transceiver_block5.2 =Ut1_PartReference_transceiver_block5.7 =Ut1_PartReference_transceiver_block5.18), transceiver_block4 (6 pins), DfMUX_ADC (10 pins), DfMUX_Power (10 pins)
VDD_EXT: Top (12 pins), transceiver_block2 (=Ct1_PartReference_transceiver_block2.1 =Ct2_PartReference_transceiver_block2.2 =Ut1_PartReference_transceiver_block2.31 =Ut1_PartReference_transceiver_block2.42), transceiver_block3 (=Ct1_PartReference_transceiver_block3.1 =Ct2_PartReference_transceiver_block3.2 =Ut1_PartReference_transceiver_block3.31 =Ut1_PartReference_transceiver_block3.42), transceiver_block6 (=Ct1_PartReference_transceiver_block6.1 =Ct2_PartReference_transceiver_block6.2 =Ut1_PartReference_transceiver_block6.31 =Ut1_PartReference_transceiver_block6.42), transceiver_block1 (=Ct1_PartReference_transceiver_block1.1 =Ct2_PartReference_transceiver_block1.2 =Ut1_PartReference_transceiver_block1.31 =Ut1_PartReference_transceiver_block1.42), transceiver_block5 (=Ct1_PartReference_transceiver_block5.1 =Ct2_PartReference_transceiver_block5.2 =Ut1_PartReference_transceiver_block5.31 =Ut1_PartReference_transceiver_block5.42), transceiver_block4 (=Ct1_PartReference_transceiver_block4.1 =Ct2_PartReference_transceiver_block4.2 =Ut1_PartReference_transceiver_block4.31 =Ut1_PartReference_transceiver_block4.42)
A_DATA0: Top (J5.3), transceiver_block6 (=UT__PartReference_transceiver_block6.16)
A_DATA0: Top (J5.29), transceiver_block2 (=UT__PartReference_transceiver_block2.16)
A_DATA0: Top (J5.49), transceiver_block1 (=UT__PartReference_transceiver_block1.16)
A_DATA0: Top (J3.3), transceiver_block4 (=UT__PartReference_transceiver_block4.16)
A_DATA0: Top (J3.23), transceiver_block3 (=UT__PartReference_transceiver_block3.16)
A_DATA0: Top (J3.50), transceiver_block5 (=UT__PartReference_transceiver_block5.16)
A_DATA1: Top (J5.4), transceiver_block6 (=UT__PartReference_transceiver_block6.15)
A_DATA1: Top (J5.30), transceiver_block2 (=UT__PartReference_transceiver_block2.15)
A_DATA1: Top (J5.50), transceiver_block1 (=UT__PartReference_transceiver_block1.15)
A_DATA1: Top (J3.51), transceiver_block5 (=UT__PartReference_transceiver_block5.15)
A_DATA1: Top (J3.4), transceiver_block4 (=UT__PartReference_transceiver_block4.15)
A_DATA1: Top (J3.24), transceiver_block3 (=UT__PartReference_transceiver_block3.15)
A_DATA2: Top (J5.5), transceiver_block6 (=UT__PartReference_transceiver_block6.14)
A_DATA2: Top (J5.31), transceiver_block2 (=UT__PartReference_transceiver_block2.14)
A_DATA2: Top (J5.51), transceiver_block1 (=UT__PartReference_transceiver_block1.14)
A_DATA2: Top (J3.5), transceiver_block4 (=UT__PartReference_transceiver_block4.14)
A_DATA2: Top (J3.25), transceiver_block3 (=UT__PartReference_transceiver_block3.14)
A_DATA2: Top (J3.52), transceiver_block5 (=UT__PartReference_transceiver_block5.14)
A_DATA3: Top (J5.6), transceiver_block6 (=UT__PartReference_transceiver_block6.13)
A_DATA3: Top (J5.32), transceiver_block2 (=UT__PartReference_transceiver_block2.13)
A_DATA3: Top (J5.52), transceiver_block1 (=UT__PartReference_transceiver_block1.13)
A_DATA3: Top (J3.53), transceiver_block5 (=UT__PartReference_transceiver_block5.13)
A_DATA3: Top (J3.6), transceiver_block4 (=UT__PartReference_transceiver_block4.13)
A_DATA3: Top (J3.26), transceiver_block3 (=UT__PartReference_transceiver_block3.13)
A_DATA4: Top (J5.7), transceiver_block6 (=UT__PartReference_transceiver_block6.12)
A_DATA4: Top (J5.33), transceiver_block2 (=UT__PartReference_transceiver_block2.12)
A_DATA4: Top (J5.53), transceiver_block1 (=UT__PartReference_transceiver_block1.12)
A_DATA4: Top (J3.7), transceiver_block4 (=UT__PartReference_transceiver_block4.12)
A_DATA4: Top (J3.27), transceiver_block3 (=UT__PartReference_transceiver_block3.12)
A_DATA4: Top (J3.54), transceiver_block5 (=UT__PartReference_transceiver_block5.12)
A_DATA5: Top (J5.8), transceiver_block6 (=UT__PartReference_transceiver_block6.11)
A_DATA5: Top (J5.34), transceiver_block2 (=UT__PartReference_transceiver_block2.11)
A_DATA5: Top (J5.54), transceiver_block1 (=UT__PartReference_transceiver_block1.11)
A_DATA5: Top (J3.55), transceiver_block5 (=UT__PartReference_transceiver_block5.11)
A_DATA5: Top (J3.8), transceiver_block4 (=UT__PartReference_transceiver_block4.11)
A_DATA5: Top (J3.28), transceiver_block3 (=UT__PartReference_transceiver_block3.11)
A_DATA6: Top (J5.9), transceiver_block6 (=UT__PartReference_transceiver_block6.10)
A_DATA6: Top (J5.35), transceiver_block2 (=UT__PartReference_transceiver_block2.10)
A_DATA6: Top (J5.55), transceiver_block1 (=UT__PartReference_transceiver_block1.10)
A_DATA6: Top (J3.9), transceiver_block4 (=UT__PartReference_transceiver_block4.10)
A_DATA6: Top (J3.29), transceiver_block3 (=UT__PartReference_transceiver_block3.10)
A_DATA6: Top (J3.56), transceiver_block5 (=UT__PartReference_transceiver_block5.10)
A_DATA7: Top (J5.10), transceiver_block6 (=UT__PartReference_transceiver_block6.9)
A_DATA7: Top (J5.36), transceiver_block2 (=UT__PartReference_transceiver_block2.9)
A_DATA7: Top (J5.56), transceiver_block1 (=UT__PartReference_transceiver_block1.9)
A_DATA7: Top (J3.57), transceiver_block5 (=UT__PartReference_transceiver_block5.9)
A_DATA7: Top (J3.10), transceiver_block4 (=UT__PartReference_transceiver_block4.9)
A_DATA7: Top (J3.30), transceiver_block3 (=UT__PartReference_transceiver_block3.9)
A_DATA8: Top (J5.11), transceiver_block6 (=UT__1_PartReference_transceiver_block6.16)
A_DATA8: Top (J5.37), transceiver_block2 (=UT__1_PartReference_transceiver_block2.16)
A_DATA8: Top (J5.57), transceiver_block1 (=UT__1_PartReference_transceiver_block1.16)
A_DATA8: Top (J3.11), transceiver_block4 (=UT__1_PartReference_transceiver_block4.16)
A_DATA8: Top (J3.31), transceiver_block3 (=UT__1_PartReference_transceiver_block3.16)
A_DATA8: Top (J3.58), transceiver_block5 (=UT__1_PartReference_transceiver_block5.16)
A_DATA9: Top (J5.12), transceiver_block6 (=UT__1_PartReference_transceiver_block6.15)
A_DATA9: Top (J5.38), transceiver_block2 (=UT__1_PartReference_transceiver_block2.15)
A_DATA9: Top (J5.58), transceiver_block1 (=UT__1_PartReference_transceiver_block1.15)
A_DATA9: Top (J3.59), transceiver_block5 (=UT__1_PartReference_transceiver_block5.15)
A_DATA9: Top (J3.12), transceiver_block4 (=UT__1_PartReference_transceiver_block4.15)
A_DATA9: Top (J3.32), transceiver_block3 (=UT__1_PartReference_transceiver_block3.15)
A_DATA10: Top (J5.13), transceiver_block6 (=UT__1_PartReference_transceiver_block6.14)
A_DATA10: Top (J5.39), transceiver_block2 (=UT__1_PartReference_transceiver_block2.14)
A_DATA10: Top (J5.59), transceiver_block1 (=UT__1_PartReference_transceiver_block1.14)
A_DATA10: Top (J3.13), transceiver_block4 (=UT__1_PartReference_transceiver_block4.14)
A_DATA10: Top (J3.33), transceiver_block3 (=UT__1_PartReference_transceiver_block3.14)
A_DATA10: Top (J3.60), transceiver_block5 (=UT__1_PartReference_transceiver_block5.14)
A_DATA11: Top (J5.14), transceiver_block6 (=UT__1_PartReference_transceiver_block6.13)
A_DATA11: Top (J5.40), transceiver_block2 (=UT__1_PartReference_transceiver_block2.13)
A_DATA11: Top (J5.60), transceiver_block1 (=UT__1_PartReference_transceiver_block1.13)
A_DATA11: Top (J3.61), transceiver_block5 (=UT__1_PartReference_transceiver_block5.13)
A_DATA11: Top (J3.14), transceiver_block4 (=UT__1_PartReference_transceiver_block4.13)
A_DATA11: Top (J3.34), transceiver_block3 (=UT__1_PartReference_transceiver_block3.13)
A_DATA12: Top (J5.15), transceiver_block6 (=UT__1_PartReference_transceiver_block6.12)
A_DATA12: Top (J5.41), transceiver_block2 (=UT__1_PartReference_transceiver_block2.12)
A_DATA12: Top (J5.61), transceiver_block1 (=UT__1_PartReference_transceiver_block1.12)
A_DATA12: Top (J3.15), transceiver_block4 (=UT__1_PartReference_transceiver_block4.12)
A_DATA12: Top (J3.35), transceiver_block3 (=UT__1_PartReference_transceiver_block3.12)
A_DATA12: Top (J3.62), transceiver_block5 (=UT__1_PartReference_transceiver_block5.12)
A_DATA13: Top (J5.16), transceiver_block6 (=UT__1_PartReference_transceiver_block6.11)
A_DATA13: Top (J5.42), transceiver_block2 (=UT__1_PartReference_transceiver_block2.11)
A_DATA13: Top (J5.62), transceiver_block1 (=UT__1_PartReference_transceiver_block1.11)
A_DATA13: Top (J3.63), transceiver_block5 (=UT__1_PartReference_transceiver_block5.11)
A_DATA13: Top (J3.16), transceiver_block4 (=UT__1_PartReference_transceiver_block4.11)
A_DATA13: Top (J3.36), transceiver_block3 (=UT__1_PartReference_transceiver_block3.11)
A_DATA14: Top (J5.17), transceiver_block6 (=UT__1_PartReference_transceiver_block6.10)
A_DATA14: Top (J5.43), transceiver_block2 (=UT__1_PartReference_transceiver_block2.10)
A_DATA14: Top (J5.63), transceiver_block1 (=UT__1_PartReference_transceiver_block1.10)
A_DATA14: Top (J3.17), transceiver_block4 (=UT__1_PartReference_transceiver_block4.10)
A_DATA14: Top (J3.37), transceiver_block3 (=UT__1_PartReference_transceiver_block3.10)
A_DATA14: Top (J3.64), transceiver_block5 (=UT__1_PartReference_transceiver_block5.10)
A_DATA15: Top (J5.44), transceiver_block2 (=UT__1_PartReference_transceiver_block2.9)
A_DATA15: Top (J5.64), transceiver_block1 (=UT__1_PartReference_transceiver_block1.9)
A_DATA15: Top (J3.18), transceiver_block4 (=UT__1_PartReference_transceiver_block4.9)
A_DATA15: Top (J3.38), transceiver_block3 (=UT__1_PartReference_transceiver_block3.9)
B_DATA0: dac_block1 (=Ud1_PartReference_dac_block1.27), transceiver_block1 (=Ut1_PartReference_transceiver_block1.2)
B_DATA0: transceiver_block2 (=Ut1_PartReference_transceiver_block2.2), dac_block2 (=Ud1_PartReference_dac_block2.27)
B_DATA0: transceiver_block3 (=Ut1_PartReference_transceiver_block3.2), dac_block3 (=Ud1_PartReference_dac_block3.27)
B_DATA0: transceiver_block6 (=Ut1_PartReference_transceiver_block6.2), DfMUX_ADC (UA1.41)
B_DATA0: transceiver_block5 (=Ut1_PartReference_transceiver_block5.2), DfMUX_ADC (UA1.24)
B_DATA0: transceiver_block4 (=Ut1_PartReference_transceiver_block4.2), dac_block4 (=Ud1_PartReference_dac_block4.27)
B_DATA1: dac_block1 (=Ud1_PartReference_dac_block1.28), transceiver_block1 (=Ut1_PartReference_transceiver_block1.3)
B_DATA1: transceiver_block2 (=Ut1_PartReference_transceiver_block2.3), dac_block2 (=Ud1_PartReference_dac_block2.28)
B_DATA1: transceiver_block3 (=Ut1_PartReference_transceiver_block3.3), dac_block3 (=Ud1_PartReference_dac_block3.28)
B_DATA1: transceiver_block6 (=Ut1_PartReference_transceiver_block6.3), DfMUX_ADC (UA1.42)
B_DATA1: transceiver_block5 (=Ut1_PartReference_transceiver_block5.3), DfMUX_ADC (UA1.25)
B_DATA1: transceiver_block4 (=Ut1_PartReference_transceiver_block4.3), dac_block4 (=Ud1_PartReference_dac_block4.28)
B_DATA2: dac_block1 (=Ud1_PartReference_dac_block1.1), transceiver_block1 (=Ut1_PartReference_transceiver_block1.5)
B_DATA2: transceiver_block2 (=Ut1_PartReference_transceiver_block2.5), dac_block2 (=Ud1_PartReference_dac_block2.1)
B_DATA2: transceiver_block3 (=Ut1_PartReference_transceiver_block3.5), dac_block3 (=Ud1_PartReference_dac_block3.1)
B_DATA2: transceiver_block6 (=Ut1_PartReference_transceiver_block6.5), DfMUX_ADC (UA1.43)
B_DATA2: transceiver_block5 (=Ut1_PartReference_transceiver_block5.5), DfMUX_ADC (UA1.26)
B_DATA2: transceiver_block4 (=Ut1_PartReference_transceiver_block4.5), dac_block4 (=Ud1_PartReference_dac_block4.1)
B_DATA3: dac_block1 (=Ud1_PartReference_dac_block1.2), transceiver_block1 (=Ut1_PartReference_transceiver_block1.6)
B_DATA3: transceiver_block2 (=Ut1_PartReference_transceiver_block2.6), dac_block2 (=Ud1_PartReference_dac_block2.2)
B_DATA3: transceiver_block3 (=Ut1_PartReference_transceiver_block3.6), dac_block3 (=Ud1_PartReference_dac_block3.2)
B_DATA3: transceiver_block6 (=Ut1_PartReference_transceiver_block6.6), DfMUX_ADC (UA1.44)
B_DATA3: transceiver_block5 (=Ut1_PartReference_transceiver_block5.6), DfMUX_ADC (UA1.27)
B_DATA3: transceiver_block4 (=Ut1_PartReference_transceiver_block4.6), dac_block4 (=Ud1_PartReference_dac_block4.2)
B_DATA4: dac_block1 (=Ud1_PartReference_dac_block1.3), transceiver_block1 (=Ut1_PartReference_transceiver_block1.8)
B_DATA4: transceiver_block2 (=Ut1_PartReference_transceiver_block2.8), dac_block2 (=Ud1_PartReference_dac_block2.3)
B_DATA4: transceiver_block3 (=Ut1_PartReference_transceiver_block3.8), dac_block3 (=Ud1_PartReference_dac_block3.3)
B_DATA4: transceiver_block6 (=Ut1_PartReference_transceiver_block6.8), DfMUX_ADC (UA1.45)
B_DATA4: transceiver_block5 (=Ut1_PartReference_transceiver_block5.8), DfMUX_ADC (UA1.28)
B_DATA4: transceiver_block4 (=Ut1_PartReference_transceiver_block4.8), dac_block4 (=Ud1_PartReference_dac_block4.3)
B_DATA5: dac_block1 (=Ud1_PartReference_dac_block1.4), transceiver_block1 (=Ut1_PartReference_transceiver_block1.9)
B_DATA5: transceiver_block2 (=Ut1_PartReference_transceiver_block2.9), dac_block2 (=Ud1_PartReference_dac_block2.4)
B_DATA5: transceiver_block3 (=Ut1_PartReference_transceiver_block3.9), dac_block3 (=Ud1_PartReference_dac_block3.4)
B_DATA5: transceiver_block6 (=Ut1_PartReference_transceiver_block6.9), DfMUX_ADC (UA1.46)
B_DATA5: transceiver_block5 (=Ut1_PartReference_transceiver_block5.9), DfMUX_ADC (UA1.29)
B_DATA5: transceiver_block4 (=Ut1_PartReference_transceiver_block4.9), dac_block4 (=Ud1_PartReference_dac_block4.4)
B_DATA6: dac_block1 (=Ud1_PartReference_dac_block1.5), transceiver_block1 (=Ut1_PartReference_transceiver_block1.11)
B_DATA6: transceiver_block2 (=Ut1_PartReference_transceiver_block2.11), dac_block2 (=Ud1_PartReference_dac_block2.5)
B_DATA6: transceiver_block3 (=Ut1_PartReference_transceiver_block3.11), dac_block3 (=Ud1_PartReference_dac_block3.5)
B_DATA6: transceiver_block6 (=Ut1_PartReference_transceiver_block6.11), DfMUX_ADC (UA1.47)
B_DATA6: transceiver_block5 (=Ut1_PartReference_transceiver_block5.11), DfMUX_ADC (UA1.30)
B_DATA6: transceiver_block4 (=Ut1_PartReference_transceiver_block4.11), dac_block4 (=Ud1_PartReference_dac_block4.5)
B_DATA7: dac_block1 (=Ud1_PartReference_dac_block1.6), transceiver_block1 (=Ut1_PartReference_transceiver_block1.12)
B_DATA7: transceiver_block2 (=Ut1_PartReference_transceiver_block2.12), dac_block2 (=Ud1_PartReference_dac_block2.6)
B_DATA7: transceiver_block3 (=Ut1_PartReference_transceiver_block3.12), dac_block3 (=Ud1_PartReference_dac_block3.6)
B_DATA7: transceiver_block6 (=Ut1_PartReference_transceiver_block6.12), DfMUX_ADC (UA1.48)
B_DATA7: transceiver_block5 (=Ut1_PartReference_transceiver_block5.12), DfMUX_ADC (UA1.33)
B_DATA7: transceiver_block4 (=Ut1_PartReference_transceiver_block4.12), dac_block4 (=Ud1_PartReference_dac_block4.6)
B_DATA8: dac_block1 (=Ud1_PartReference_dac_block1.7), transceiver_block1 (=Ut1_PartReference_transceiver_block1.13)
B_DATA8: transceiver_block2 (=Ut1_PartReference_transceiver_block2.13), dac_block2 (=Ud1_PartReference_dac_block2.7)
B_DATA8: transceiver_block3 (=Ut1_PartReference_transceiver_block3.13), dac_block3 (=Ud1_PartReference_dac_block3.7)
B_DATA8: transceiver_block6 (=Ut1_PartReference_transceiver_block6.13), DfMUX_ADC (UA1.51)
B_DATA8: transceiver_block5 (=Ut1_PartReference_transceiver_block5.13), DfMUX_ADC (UA1.34)
B_DATA8: transceiver_block4 (=Ut1_PartReference_transceiver_block4.13), dac_block4 (=Ud1_PartReference_dac_block4.7)
B_DATA9: dac_block1 (=Ud1_PartReference_dac_block1.8), transceiver_block1 (=Ut1_PartReference_transceiver_block1.14)
B_DATA9: transceiver_block2 (=Ut1_PartReference_transceiver_block2.14), dac_block2 (=Ud1_PartReference_dac_block2.8)
B_DATA9: transceiver_block3 (=Ut1_PartReference_transceiver_block3.14), dac_block3 (=Ud1_PartReference_dac_block3.8)
B_DATA9: transceiver_block6 (=Ut1_PartReference_transceiver_block6.14), DfMUX_ADC (UA1.52)
B_DATA9: transceiver_block5 (=Ut1_PartReference_transceiver_block5.14), DfMUX_ADC (UA1.35)
B_DATA9: transceiver_block4 (=Ut1_PartReference_transceiver_block4.14), dac_block4 (=Ud1_PartReference_dac_block4.8)
B_DATA10: dac_block1 (=Ud1_PartReference_dac_block1.9), transceiver_block1 (=Ut1_PartReference_transceiver_block1.16)
B_DATA10: transceiver_block2 (=Ut1_PartReference_transceiver_block2.16), dac_block2 (=Ud1_PartReference_dac_block2.9)
B_DATA10: transceiver_block3 (=Ut1_PartReference_transceiver_block3.16), dac_block3 (=Ud1_PartReference_dac_block3.9)
B_DATA10: transceiver_block6 (=Ut1_PartReference_transceiver_block6.16), DfMUX_ADC (UA1.53)
B_DATA10: transceiver_block5 (=Ut1_PartReference_transceiver_block5.16), DfMUX_ADC (UA1.36)
B_DATA10: transceiver_block4 (=Ut1_PartReference_transceiver_block4.16), dac_block4 (=Ud1_PartReference_dac_block4.9)
B_DATA11: dac_block1 (=Ud1_PartReference_dac_block1.10), transceiver_block1 (=Ut1_PartReference_transceiver_block1.17)
B_DATA11: transceiver_block2 (=Ut1_PartReference_transceiver_block2.17), dac_block2 (=Ud1_PartReference_dac_block2.10)
B_DATA11: transceiver_block3 (=Ut1_PartReference_transceiver_block3.17), dac_block3 (=Ud1_PartReference_dac_block3.10)
B_DATA11: transceiver_block6 (=Ut1_PartReference_transceiver_block6.17), DfMUX_ADC (UA1.54)
B_DATA11: transceiver_block5 (=Ut1_PartReference_transceiver_block5.17), DfMUX_ADC (UA1.37)
B_DATA11: transceiver_block4 (=Ut1_PartReference_transceiver_block4.17), dac_block4 (=Ud1_PartReference_dac_block4.10)
B_DATA12: dac_block1 (=Ud1_PartReference_dac_block1.11), transceiver_block1 (=Ut1_PartReference_transceiver_block1.19)
B_DATA12: transceiver_block2 (=Ut1_PartReference_transceiver_block2.19), dac_block2 (=Ud1_PartReference_dac_block2.11)
B_DATA12: transceiver_block3 (=Ut1_PartReference_transceiver_block3.19), dac_block3 (=Ud1_PartReference_dac_block3.11)
B_DATA12: transceiver_block6 (=Ut1_PartReference_transceiver_block6.19), DfMUX_ADC (UA1.55)
B_DATA12: transceiver_block5 (=Ut1_PartReference_transceiver_block5.19), DfMUX_ADC (UA1.38)
B_DATA12: transceiver_block4 (=Ut1_PartReference_transceiver_block4.19), dac_block4 (=Ud1_PartReference_dac_block4.11)
B_DATA13: dac_block1 (=Ud1_PartReference_dac_block1.12), transceiver_block1 (=Ut1_PartReference_transceiver_block1.20)
B_DATA13: transceiver_block2 (=Ut1_PartReference_transceiver_block2.20), dac_block2 (=Ud1_PartReference_dac_block2.12)
B_DATA13: transceiver_block3 (=Ut1_PartReference_transceiver_block3.20), dac_block3 (=Ud1_PartReference_dac_block3.12)
B_DATA13: transceiver_block6 (=Ut1_PartReference_transceiver_block6.20), DfMUX_ADC (UA1.56)
B_DATA13: transceiver_block5 (=Ut1_PartReference_transceiver_block5.20), DfMUX_ADC (UA1.39)
B_DATA13: transceiver_block4 (=Ut1_PartReference_transceiver_block4.20), dac_block4 (=Ud1_PartReference_dac_block4.12)
B_DATA14: dac_block1 (=Ud1_PartReference_dac_block1.13), transceiver_block1 (=Ut1_PartReference_transceiver_block1.22)
B_DATA14: transceiver_block2 (=Ut1_PartReference_transceiver_block2.22), dac_block2 (=Ud1_PartReference_dac_block2.13)
B_DATA14: transceiver_block3 (=Ut1_PartReference_transceiver_block3.22), dac_block3 (=Ud1_PartReference_dac_block3.13)
B_DATA14: transceiver_block6 (=Ut1_PartReference_transceiver_block6.22), DfMUX_ADC (UA1.57)
B_DATA14: transceiver_block5 (=Ut1_PartReference_transceiver_block5.22), DfMUX_ADC (UA1.40)
B_DATA14: transceiver_block4 (=Ut1_PartReference_transceiver_block4.22), dac_block4 (=Ud1_PartReference_dac_block4.13)
B_DATA15: dac_block1 (=Ud1_PartReference_dac_block1.14), transceiver_block1 (=Ut1_PartReference_transceiver_block1.23)
B_DATA15: transceiver_block2 (=Ut1_PartReference_transceiver_block2.23), dac_block2 (=Ud1_PartReference_dac_block2.14)
B_DATA15: transceiver_block3 (=Ut1_PartReference_transceiver_block3.23), dac_block3 (=Ud1_PartReference_dac_block3.14)
B_DATA15: transceiver_block4 (=Ut1_PartReference_transceiver_block4.23), dac_block4 (=Ud1_PartReference_dac_block4.14)
Net=Rd31_PartReference_dac_block1_2: Top (J4.8), dac_block1 (=Rd31_PartReference_dac_block1.2)
Net=Rd31_PartReference_dac_block2_2: Top (J4.7), dac_block2 (=Rd31_PartReference_dac_block2.2)
Net=Rd31_PartReference_dac_block3_2: Top (J4.2), dac_block3 (=Rd31_PartReference_dac_block3.2)
Net=Rd31_PartReference_dac_block4_2: Top (J4.1), dac_block4 (=Rd31_PartReference_dac_block4.2)
Net=Rd32_PartReference_dac_block1_2: Top (J4.15), dac_block1 (=Rd32_PartReference_dac_block1.2)
Net=Rd32_PartReference_dac_block2_2: Top (J4.14), dac_block2 (=Rd32_PartReference_dac_block2.2)
Net=Rd32_PartReference_dac_block3_2: Top (J4.10), dac_block3 (=Rd32_PartReference_dac_block3.2)
Net=Rd32_PartReference_dac_block4_2: Top (J4.9), dac_block4 (=Rd32_PartReference_dac_block4.2)
Net=Rd34_PartReference_dac_block1_2: Top (UT31.22), dac_block1 (=Rd34_PartReference_dac_block1.2 =Ud3_PartReference_dac_block1.14)
Net=Rd34_PartReference_dac_block2_2: Top (UT31.19), dac_block2 (=Rd34_PartReference_dac_block2.2 =Ud3_PartReference_dac_block2.14)
Net=Rd34_PartReference_dac_block3_2: Top (UT31.5), dac_block3 (=Rd34_PartReference_dac_block3.2 =Ud3_PartReference_dac_block3.14)
Net=Rd34_PartReference_dac_block4_2: Top (UT31.2), dac_block4 (=Rd34_PartReference_dac_block4.2 =Ud3_PartReference_dac_block4.14)
Net=Rd35_PartReference_dac_block1_2: Top (UT31.23), dac_block1 (=Rd35_PartReference_dac_block1.2 =Ud3_PartReference_dac_block1.2)
Net=Rd35_PartReference_dac_block2_2: Top (UT31.20), dac_block2 (=Rd35_PartReference_dac_block2.2 =Ud3_PartReference_dac_block2.2)
Net=Rd35_PartReference_dac_block3_2: Top (UT31.6), dac_block3 (=Rd35_PartReference_dac_block3.2 =Ud3_PartReference_dac_block3.2)
Net=Rd35_PartReference_dac_block4_2: Top (UT31.3), dac_block4 (=Rd35_PartReference_dac_block4.2 =Ud3_PartReference_dac_block4.2)
Net=Rd37_PartReference_dac_block1_2: dac_block1 (=Rd37_PartReference_dac_block1.2), DfMUX_ADC (RA7.1), dac_block2 (=Rd38_PartReference_dac_block2.2)
Net=Rd37_PartReference_dac_block4_2: dac_block4 (=Rd37_PartReference_dac_block4.2), DfMUX_ADC (RA49.1), dac_block3 (=Rd38_PartReference_dac_block3.2)
Net=Ud1_PartReference_dac_block1_26: Top (UT31.17), dac_block1 (=Ud1_PartReference_dac_block1.26), dac_block2 (=Ud1_PartReference_dac_block2.26)
Net=Ud1_PartReference_dac_block3_26: Top (UT31.8), dac_block4 (=Ud1_PartReference_dac_block4.26), dac_block3 (=Ud1_PartReference_dac_block3.26)
NetCA46_1: Top (J4.11), DfMUX_ADC (CA46.1), DfMUX_Power (RP56.2)
NetCA47_2: Top (J4.3), DfMUX_ADC (CA47.2), DfMUX_Power (RP27.2)
NetCA48_1: Top (J4.13), DfMUX_ADC (CA48.1), DfMUX_Power (RP59.2)
NetCA49_2: Top (J4.6), DfMUX_ADC (CA49.2), DfMUX_Power (RP33.1)
NetCP5_1: Top (J5.79 J5.80 J5.81 J5.82), DfMUX_Power (5 pins)
NetCP12_1: Top (J5.77 J5.78), DfMUX_Power (CP12.1 LP3.1 RP13.1)
NetCP17_2: Top (J5.83 J5.84), DfMUX_Power (CP17.2 LP4.1)
NetJ5_74: Top (J5.74), DfMUX_Power (RP1.1 RP4.1)
NetRA1_1: Top (UT31.9), DfMUX_ADC (RA1.1 UA1.8 UA1.9)
NetRA10_2: Top (UT31.11), DfMUX_ADC (RA10.2 UA3.14)
NetRA30_2: Top (UT31.12), DfMUX_ADC (RA30.2 UA3.2)
NetRA31_2: Top (UT31.13), DfMUX_ADC (RA31.2 UA6.14)
NetRA55_2: Top (UT31.14), DfMUX_ADC (RA55.2 UA6.2)
NetUP5_15: Top (UT32.13), DfMUX_Power (UP5.15 UP6.6)
POWER_DATA0: Top (UT32.2), DfMUX_Power (UP5.14 UP6.2)
POWER_DATA1: Top (UT32.3), DfMUX_Power (UP5.16 UP6.4)
POWER_DATA2: Top (UT32.5), DfMUX_Power (UP5.1)
POWER_DATA3: Top (UT32.6), DfMUX_Power (UP6.5)
POWER_DATA4: Top (UT32.8), DfMUX_Power (DP5.1)